# Altium project SmartGarden.PrjPcb
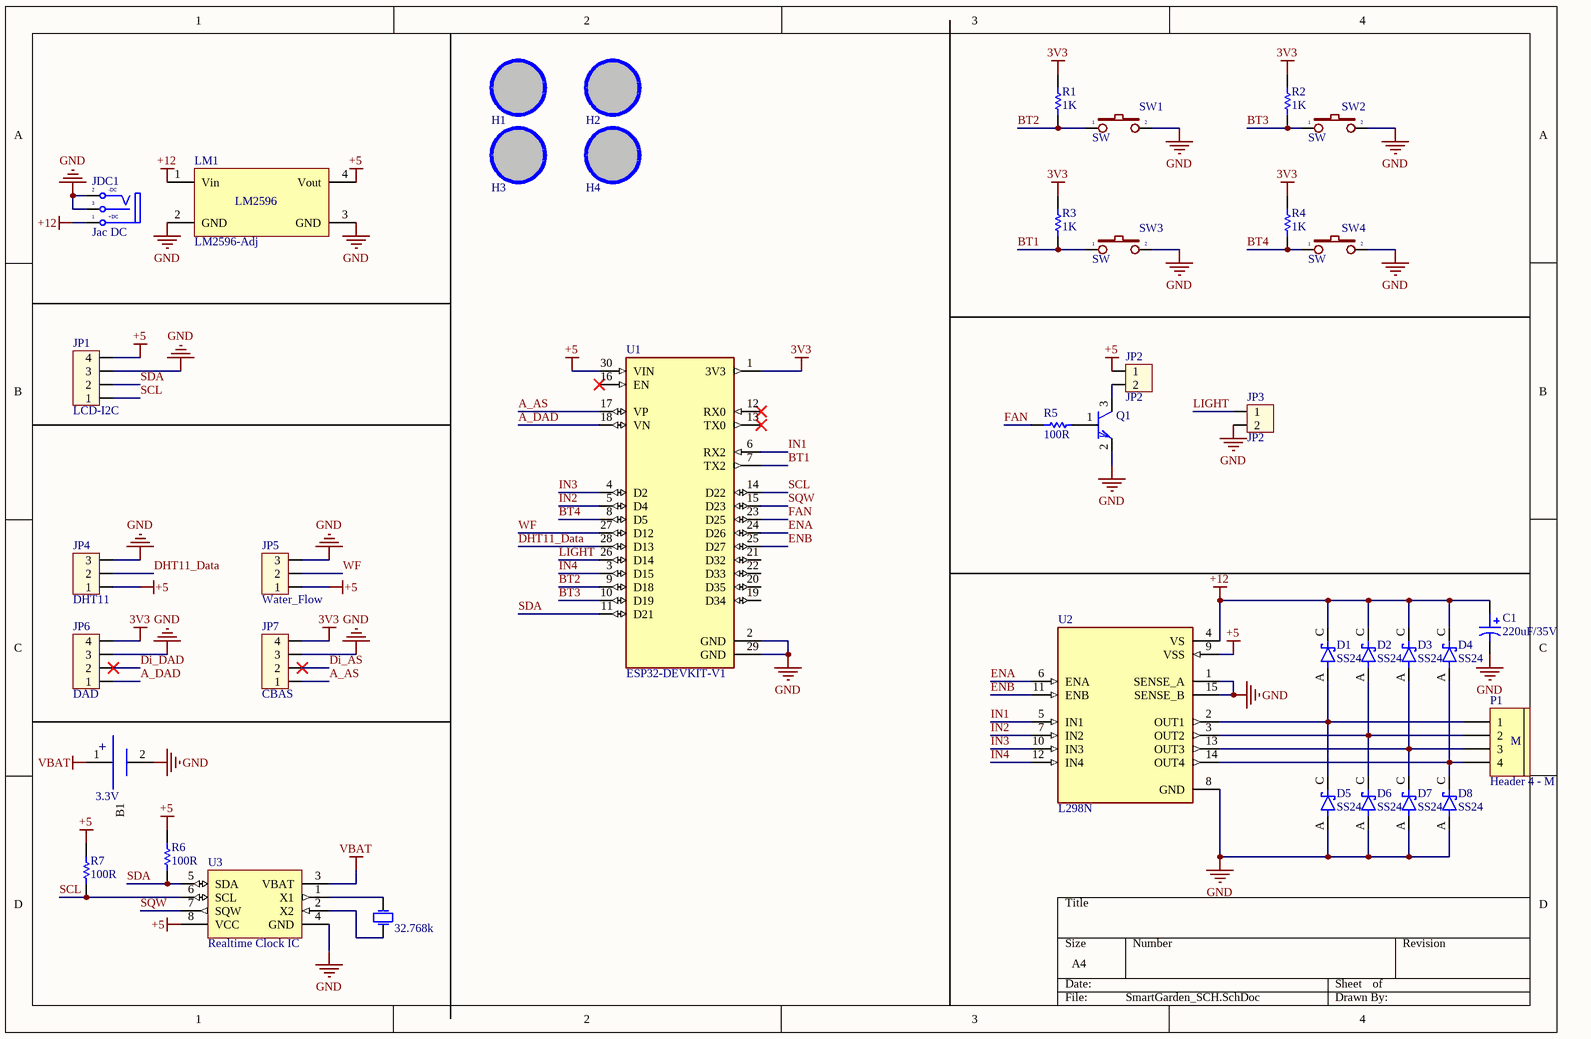
[diagram p0: SmartGarden_SCH.SchDoc]
1 sheet, 40 parts. Net scope: global (net labels, ports and power ports of the same name join across sheets).
Board file: SmartGarden_PCB.PcbDoc

## Sheet SmartGarden_SCH.SchDoc
size A4; SheetNumber: 1; SheetTotal: 1

### Parts
B1  value 3.3V  [BATT-LI-Bott-22mm]  (hidden comment: BATT-Holder)
C1  value 220uF/35V  [RADIAL E]  (hidden comment: Cap Pol)
D1  SS24  [DIOM5336X265N]
D2  SS24  [DIOM5336X265N]
D3  SS24  [DIOM5336X265N]
D4  SS24  [DIOM5336X265N]
D5  SS24  [DIOM5336X265N]
D6  SS24  [DIOM5336X265N]
D7  SS24  [DIOM5336X265N]
D8  SS24  [DIOM5336X265N]
H1  Hole  [LO KHOAN 3MM]  (value not drawn)
H2  Hole  [LO KHOAN 3MM]  (value not drawn)
H3  Hole  [LO KHOAN 3MM]  (value not drawn)
H4  Hole  [LO KHOAN 3MM]  (value not drawn)
JDC1  Jac DC  [DC-IN]
JP1  LCD-I2C  [CON4]
JP2  JP2  [CON2]
JP3  JP2  [CON2]
JP4  DHT11  [CON3]
JP5  Water_Flow  [CON3]
JP6  DAD  [CON4]
JP7  CBAS  [CON4]
LM1  LM2596-Adj  [lm2596]
P1  Header 4 - M  [Medium - Header 4]
Q1  C1815  [SOT23 [C1815]]  (value not drawn)
R1  value 1K  [R-0805]  (hidden comment: RESISTOR)
R2  value 1K  [R-0805]  (hidden comment: RESISTOR)
R3  value 1K  [R-0805]  (hidden comment: RESISTOR)
R4  value 1K  [R-0805]  (hidden comment: RESISTOR)
R5  value 100R  [R-0805]  (hidden comment: RESISTOR)
R6  value 100R  [R-0805]  (hidden comment: RESISTOR)
R7  value 100R  [R-0805]  (hidden comment: RESISTOR)
SW1  SW  [SW2]
SW2  SW  [SW2]
SW3  SW  [SW2]
SW4  SW  [SW2]
U1  ESP32-DEVKIT-V1  [MODULE_ESP32_DEVKIT_V1]
U2  L298N  [TO127P2020X500X2100-15]
U3  Realtime Clock IC  [DS1307.Dip8]
Y1  32.768k  [XT32kn]

### Nets
3V3: JP6.4 JP7.4 R1.2 R2.2 R3.2 R4.2 U1.1(3V3)
+5: JP1.4 JP2.1 JP4.1 JP5.1 LM1.4(Vout) R6.1 R7.1 U1.30(VIN) U2.9(VSS) U3.8(VCC)
+12: C1.1 D1.C(K) D2.C(K) D3.C(K) D4.C(K) JDC1.1(T) LM1.1(Vin) U2.4(VS)
GND: B1.2(-) C1.2 D5.A D6.A D7.A D8.A JDC1.2(TN) JDC1.3(S) JP1.3 JP3.2 JP4.3 JP5.3 JP6.3 JP7.3 LM1.2(GND) LM1.3(GND) Q1.2(E) SW1.2 SW2.2 SW3.2 SW4.2 U1.2(GND) U1.29(GND) U2.1(SENSE_A) U2.8(GND) U2.15(SENSE_B) U3.4(GND)
VBAT: B1.1(+) U3.3(VBAT)
A_AS: JP7.1 U1.17(VP)
A_DAD: JP6.1 U1.18(VN)
BT1: R3.1 SW3.1 U1.7(TX2)
BT2: R1.1 SW1.1 U1.9(D18)
BT3: R2.1 SW2.1 U1.10(D19)
BT4: R4.1 SW4.1 U1.8(D5)
DHT11_Data: JP4.2 U1.28(D13)
Di_AS: JP7.2
Di_DAD: JP6.2
ENA: U1.24(D26) U2.6(ENA)
ENB: U1.25(D27) U2.11(ENB)
FAN: R5.2 U1.23(D25)
IN1: U1.6(RX2) U2.5(IN1)
IN2: U1.5(D4) U2.7(IN2)
IN3: U1.4(D2) U2.10(IN3)
IN4: U1.3(D15) U2.12(IN4)
LIGHT: JP3.1 U1.26(D14)
SCL: JP1.1 R7.2 U1.14(D22) U3.6(SCL)
SDA: JP1.2 R6.2 U1.11(D21) U3.5(SDA)
SQW: U1.15(D23) U3.7(SQW)
WF: JP5.2 U1.27(D12)
NetD1_A: D1.A D5.C(K) P1.1 U2.2(OUT1)
NetD2_A: D2.A D6.C(K) P1.2 U2.3(OUT2)
NetD3_A: D3.A D7.C(K) P1.3 U2.13(OUT3)
NetD4_A: D4.A D8.C(K) P1.4 U2.14(OUT4)
NetJP2_2: JP2.2 Q1.3(C)
NetQ1_1: Q1.1(B) R5.1
NetU3_1: U3.1(X1) Y1.2(OSC2)
NetU3_2: U3.2(X2) Y1.1(OSC1)

Not connected (* = marked no-connect by the designer): H1 1; H2 1; H3 1; H4 1; U1 12(RX0)* 13(TX0)* 16(EN)* 19(D34) 20(D35) 21(D32) 22(D33)

### Notes on the sheet
- (in symbol DCIN) -DC; +DC
- (in symbol Header 4 - M) M
- (in symbol LM2596-Adj) LM2596

### Library data of the parts
B1 = BATT-Holder: Battery holder; Manufacturer: China; Vendor: Digikey; Publisher: Hoang Nguyen; Published: 13-April-2009; ComponentLink1Description: Digikey Part Link; ComponentLink2Description: Open Datasheet; ComponentLink2URL: H:\LIBRARY\LIBRARY.Datasheet\; Price: 3000 VND
C1 = Cap Pol: Polarized Capacitor; Published: 8-Jun-2000; LatestRevisionDate: 17-Jul-2002; LatestRevisionNote: Re-released for DXP Platform.; PackageReference: POLAR0.8; Publisher: Altium Limited
D1-D8 = SS24: Diode Schottky 40V 2A Surface Mount DO-214AA (SMB); MF: ON Semiconductor; Package: DO-214AA ON Semiconductor; Price: None; Value: *; SnapEDA_Link: https://www.snapeda.com/parts/SS24/Onsemi/view-part/?ref=snap; MP: SS24; Availability: In Stock; Check_prices: https://www.snapeda.com/parts/SS24/Onsemi/view-part/?ref=eda
H1-H4 = Hole: Hole 3mm
JDC1 = DCIN: Jac DC input; Value: Jac DC
JP1 JP6 JP7 = Con4: Connector 4; Value: Connector 4
JP2 JP3 = Con2: Connector 2; Value: Connector 2
JP4 JP5 = Con3: Connector 3; Value: Connector 3
LM1 = LM2596-Adj: Designed By @Alixahedi
P1 = Header 4 - M: Header, 3-Pin, Medium; LatestRevisionDate: 17-Jul-2002; LatestRevisionNote: Re-released for DXP Platform.; Publisher: Altium Limited
Q1 = C1815: Q2SC1815; PSpiceTemplate: Q^@REFDES %c %b %e @MODEL; Vendor: Digikey; COMPONENT: 2SC1815; Published: 13-April-2009; Publisher: Hoang Nguyen; ComponentLink1Description: Digikey Part Link; ComponentLink2Description: Open Datasheet; ComponentLink2URL: H:\LIBRARY\LIBRARY.Datasheet\; Price: 500VND
SW1-SW4 = SW2: Switch button 2 pin; Value: SW chip 2 pin
U1 = ESP32-DEVKIT-V1: Dual core, Wi-Fi: 2.4 GHz up to 150 Mbits/s,BLE (Bluetooth Low Energy) and legacy Bluetooth, 32 bits, Up to 240 MHz; MF: Do it; Price: None; Availability: Not in stock; Package: None; MP: ESP32-DEVKIT-V1; Value: *; SnapEDA_Link: https://www.snapeda.com/parts/ESP32-DEVKIT-V1/Do+it/view-part/?ref=snap; Check_prices: https://www.snapeda.com/parts/ESP32-DEVKIT-V1/Do+it/view-part/?ref=eda
U2 = L298N: Dual Full Bridge Motor Driver 15-Pin(15+Tab) MULTIWATT V Tube; MP: L298N; Availability: Unavailable; Package: None; Value: *; Price: None
U3 = DS1307: Manufacturer: Maxim; ComponentLink1Description: Digikey Part Link; ComponentLink2Description: Open Datasheet; ComponentLink2URL: H:\LIBRARY\LIBRARY.Datasheet\DS1307.pdf
Y1 = Crystal: Crystal Oscillator; Published: 8-Jun-2000; LatestRevisionDate: 17-Jul-2002; LatestRevisionNote: Re-released for DXP Platform.; PackageReference: R38; Publisher: Altium Limited
R1-R7 = RESISTOR: Published: 8-Jun-2000; LatestRevisionDate: 17-Jul-2002; LatestRevisionNote: Re-released for DXP Platform.; PackageReference: AXIAL-0.3; Publisher: Altium Limited